# EAGLE design Timer-Ruler_v3 (EAGLE 7.5.0)
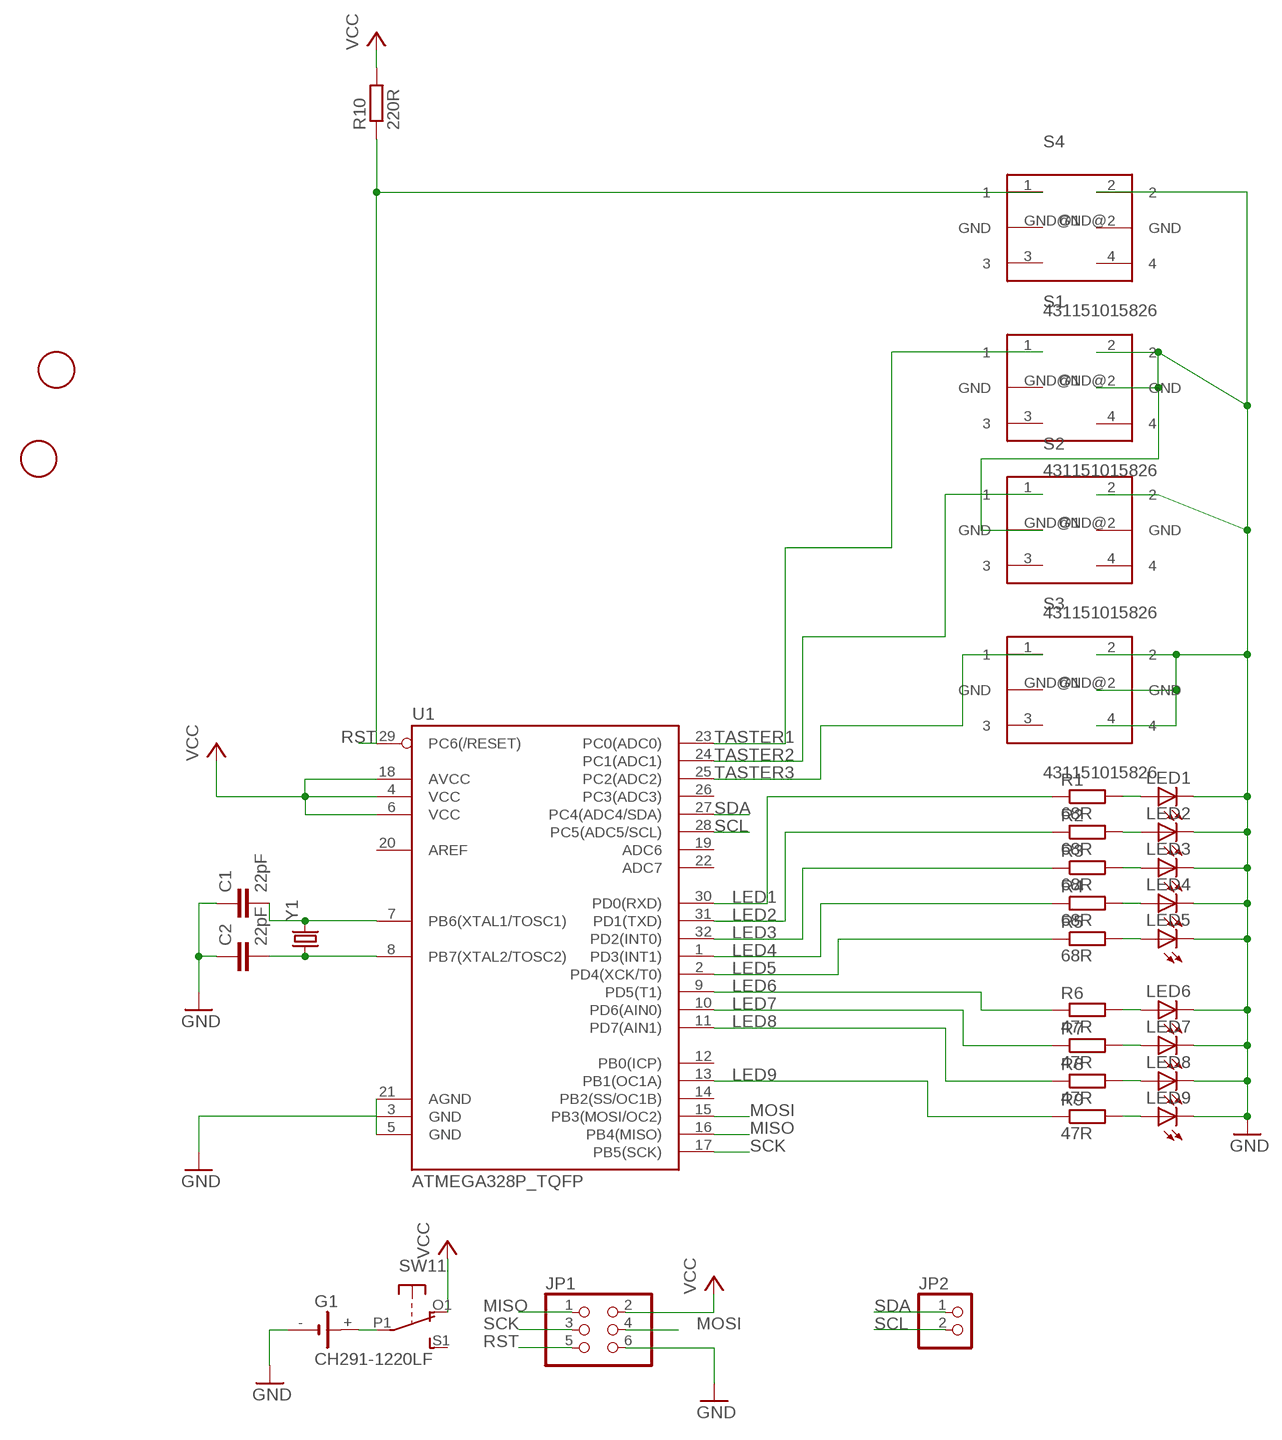
[diagram p0: schematic, sheet 1]

## Parts
C1  22pF  C-EUC0603  [C0603]
C2  22pF  C-EUC0603  [C0603]
G1  CH291-1220LF  [CH291-1220LF]
JP1  PINHD-2X3  [2X03]
JP2  PINHD-1X2  [1X02]
LED1  LEDCHIP-LED0805  [CHIP-LED0805]
LED2  LEDCHIP-LED0805  [CHIP-LED0805]
LED3  LEDCHIP-LED0805  [CHIP-LED0805]
LED4  LEDCHIP-LED0805  [CHIP-LED0805]
LED5  LEDCHIP-LED0805  [CHIP-LED0805]
LED6  LEDCHIP-LED0805  [CHIP-LED0805]
LED7  LEDCHIP-LED0805  [CHIP-LED0805]
LED8  LEDCHIP-LED0805  [CHIP-LED0805]
LED9  LEDCHIP-LED0805  [CHIP-LED0805]
R1  68R  R-EU_R0603  [R0603]
R2  68R  R-EU_R0603  [R0603]
R3  68R  R-EU_R0603  [R0603]
R4  68R  R-EU_R0603  [R0603]
R5  68R  R-EU_R0603  [R0603]
R6  47R  R-EU_R0603  [R0603]
R7  47R  R-EU_R0603  [R0603]
R8  47R  R-EU_R0603  [R0603]
R9  47R  R-EU_R0603  [R0603]
R10  220R  R-EU_R0603  [R0603]
S1  431151015826  [431181015816]
S2  431151015826  [431181015816]
S3  431151015826  [431181015816]
S4  431151015826  [431181015816]
SW1  DPDT-EG1390  [EG1390]
U1  ATMEGA328P_TQFP  [TQFP32-08]
U$1  FIDUCIAL  [FIDUCIAL_1MM]
U$2  FIDUCIAL  [FIDUCIAL_1MM]
Y1  CRYSTALCRYSTAL-SMD-5X3-12.288MHZ  [CRYSTAL-SMD-5X3]

## Nets
GND: C1.1 C2.1 G1.- JP1.6 LED1.C LED2.C LED3.C LED4.C LED5.C LED6.C LED7.C LED8.C LED9.C S1.2 S1.GND@2(GND) S2.2 S2.GND@1(GND) S3.2 S3.4 S3.GND@2(GND) S4.2 U1.3(GND)
LED1: R1.1 U1.30(PD0(RXD))
LED2: R2.1 U1.31(PD1(TXD))
LED3: R3.1 U1.32(PD2(INT0))
LED4: R4.1 U1.1(PD3(INT1))
LED5: R5.1 U1.2(PD4(XCK/T0))
LED6: R6.1 U1.9(PD5(T1))
LED7: R7.1 U1.10(PD6(AIN0))
LED8: R8.1 U1.11(PD7(AIN1))
LED9: R9.1 U1.13(PB1(OC1A))
MISO: JP1.1 U1.16(PB4(MISO))
MOSI: JP1.4 U1.15(PB3(MOSI/OC2))
N$1: LED1.A R1.2
N$2: LED2.A R2.2
N$3: LED3.A R3.2
N$4: LED4.A R4.2
N$5: LED5.A R5.2
N$6: LED6.A R6.2
N$7: LED7.A R7.2
N$8: LED8.A R8.2
N$9: LED9.A R9.2
N$10: C1.2 U1.7(PB6(XTAL1/TOSC1)) Y1.3
N$12: C2.2 U1.8(PB7(XTAL2/TOSC2)) Y1.1
N$13: U1.5(GND) U1.21(AGND)
N$14: G1.+ SW1.P1(1:P)
RST: JP1.5 R10.1 S4.1 U1.29(PC6(/RESET))
SCK: JP1.3 U1.17(PB5(SCK))
SCL: JP2.2 U1.28(PC5(ADC5/SCL))
SDA: JP2.1 U1.27(PC4(ADC4/SDA))
TASTER1: S1.1 U1.23(PC0(ADC0))
TASTER2: S2.1 U1.24(PC1(ADC1))
TASTER3: S3.1 U1.25(PC2(ADC2))
VCC: JP1.2 R10.2 SW1.O1(1:O) U1.4(VCC) U1.6(VCC) U1.18(AVCC)
Unconnected: S1.3 S1.4 S1.GND@1(GND) S2.3 S2.4 S2.GND@2(GND) S3.3 S3.GND@1(GND) S4.3 S4.4 S4.GND@1(GND) S4.GND@2(GND) SW1.O2(2:O) SW1.P2(2:P) SW1.S1(1:S) SW1.S2(2:S) U1.12(PB0(ICP)) U1.14(PB2(SS/OC1B)) U1.19(ADC6) U1.20(AREF) U1.22(ADC7) U1.26(PC3(ADC3))

## Library data of the parts
C1 C2 = resistor:C-EU: CAPACITOR, European symbol
G1 = battery:CH291-1220LF: Battery Holder, SMT, 12mm multicomp PART NO. CH291-1220LF Source: Data sheet <http://www.farnell.com/datasheets/1505860.pdf>
JP1 = pinhead:PINHD-2X3: PIN HEADER
JP2 = pinhead:PINHD-1X2: PIN HEADER
LED1-LED9 = led:LED: LED OSRAM: - CHIPLED LG R971, LG N971, LY N971, LG Q971, LY Q971, LO R971, LY R971 LH N974, LH R974 LS Q976, LO Q976, LY Q976 LO Q996 - Hyper CHIPLED LW Q18S LB Q993, LB Q99A, LB R99A - SideLED LS A670, LO A670, LY A670, LG A670, LP A670 LB A673, LV A673, LT A673, LW A673 LH A674 LY A675 LS A676, LA A676, LO A676, LY A676, LW A676 LS A679, LY A679, LG A679 - Hyper Micro SIDELED® LS Y876, LA Y876, LO Y876, LY Y876 LT Y87S - SmartLED LW L88C, LW L88S LB L89C, LB L89S, LG L890 LS L89K, LO L89K, LY L89K LS L896, LA L896, LO L896, LY L896 - TOPLED LS T670, LO T670, LY T670, LG T670, LP T670 LSG T670, LSP T670, LSY T670, LOP T670, LYG T670 LG T671, LOG T671, LSG T671 LB T673, LV T673, LT T673, LW T673 LH T674 LS T676, LA T676, LO T676, LY T676, LB T676, LH T676, LSB T676, LW T676 LB T67C, LV T67C, LT T67C, LS T67K, LO T67K, LY T67K, LW E67C LS E67B, LA E67B, LO E67B, LY E67B, LB E67C, LV E67C, LT E67C LW T67C LS T679, LY T679, LG T679 LS T770, LO T770, LY T770, LG T770, LP T770 LB T773, LV T773, LT T773, LW T773 LH T774 LS E675, LA E675, LY E675, LS T675 LS T776, LA T776, LO T776, LY T776, LB T776 LHGB T686 LT T68C, LB T68C - Hyper Mini TOPLED® LB M676 - Mini TOPLED Santana® LG M470 LS M47K, LO M47K, LY M47K Source: http://www.osram.convergy.de LUXEON: - LUMILED® LXK2-PW12-R00, LXK2-PW12-S00, LXK2-PW14-U00, LXK2-PW14-V00 LXK2-PM12-R00, LXK2-PM12-S00, LXK2-PM14-U00 LXK2-PE12-Q00, LXK2-PE12-R00, LXK2-PE12-S00, LXK2-PE14-T00, LXK2-PE14-U00 LXK2-PB12-K00, LXK2-PB12-L00, LXK2-PB12-M00, LXK2-PB14-N00, LXK2-PB14-P00, LXK2-PB14-Q00 LXK2-PR12-L00, LXK2-PR12-M00, LXK2-PR14-Q00, LXK2-PR14-R00 LXK2-PD12-Q00, LXK2-PD12-R00, LXK2-PD12-S00 LXK2-PH12-R00, LXK2-PH12-S00 LXK2-PL12-P00, LXK2-PL12-Q00, LXK2-PL12-R00 Source: www.luxeon.com KINGBRIGHT: KA-3528ASYC Source: www.kingbright.com
R1-R10 = resistor:R-EU_: RESISTOR, European symbol
S1-S4 = Wurth_Elektronik_Electromechanic_Switchs_rev15b:431151015826: WS-TSS-5x5 mm SMD Tact Switch with ground terminal, 4 pins
SW1 = adafruit:DPDT
U1 = SparkFun-DigitalIC:ATMEGA328P_TQFP; PROD_ID: IC-09069
U$1 U$2 = adafruit:FIDUCIAL: For use by pick and place machines to calibrate the vision/machine, 1mm By microbuilder.eu
Y1 = SparkFun-FreqCtrl:CRYSTAL: Various standard crystals. Proven footprints.; PROD_ID: XTAL-09653

## Board
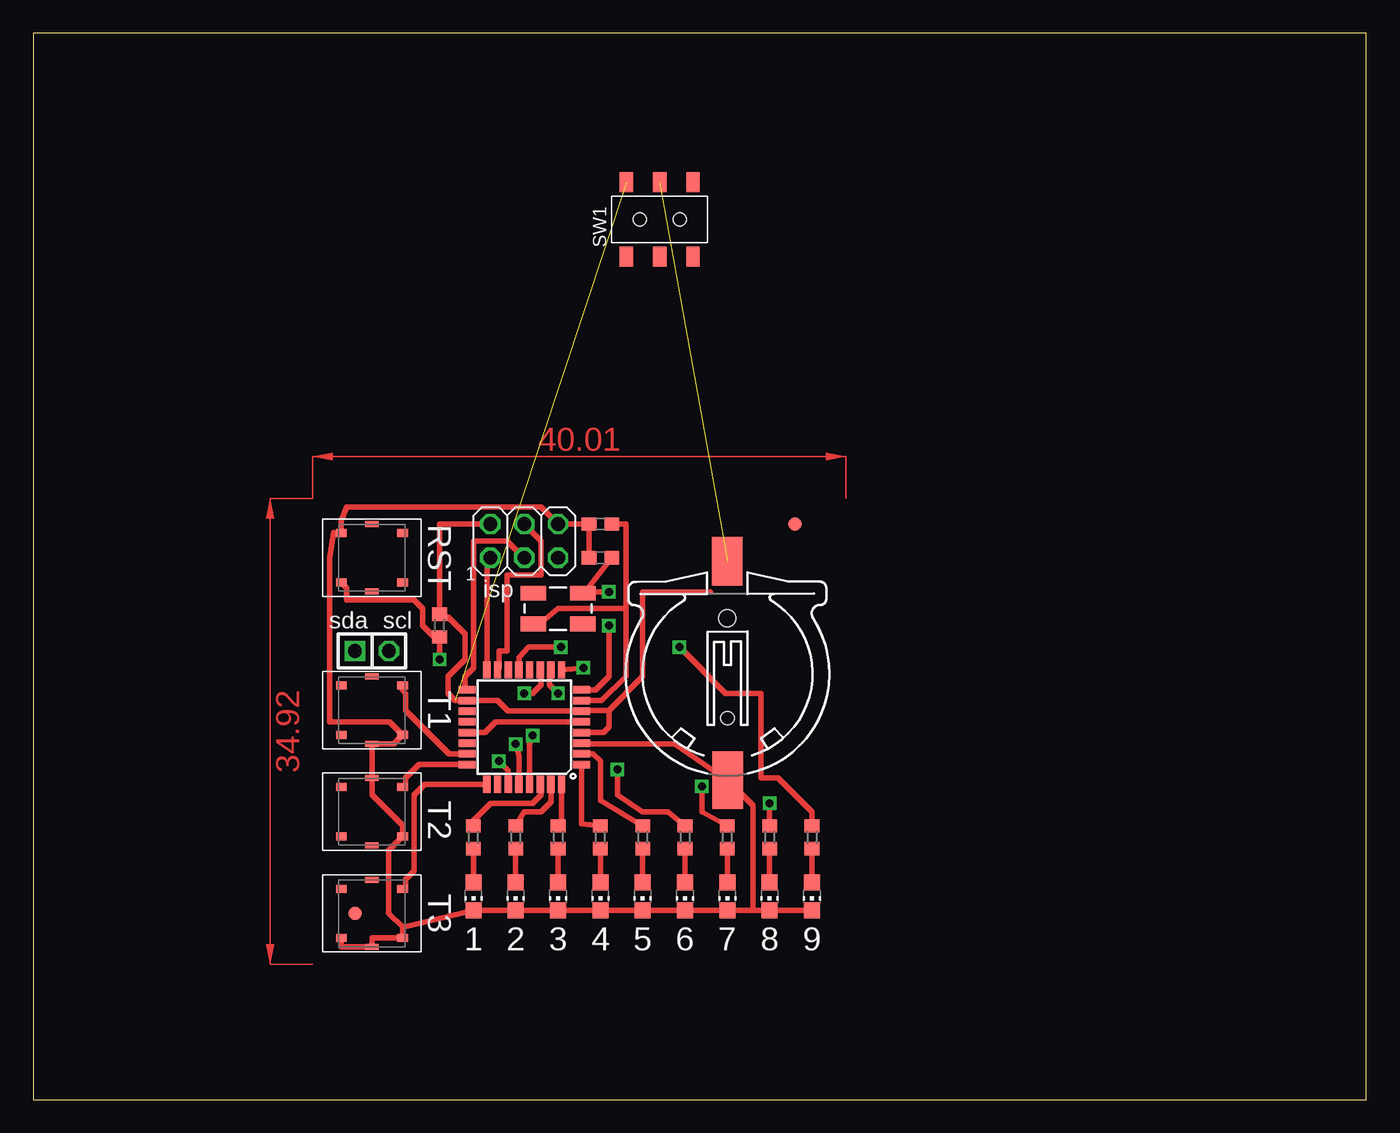
[diagram p1: board, top side]
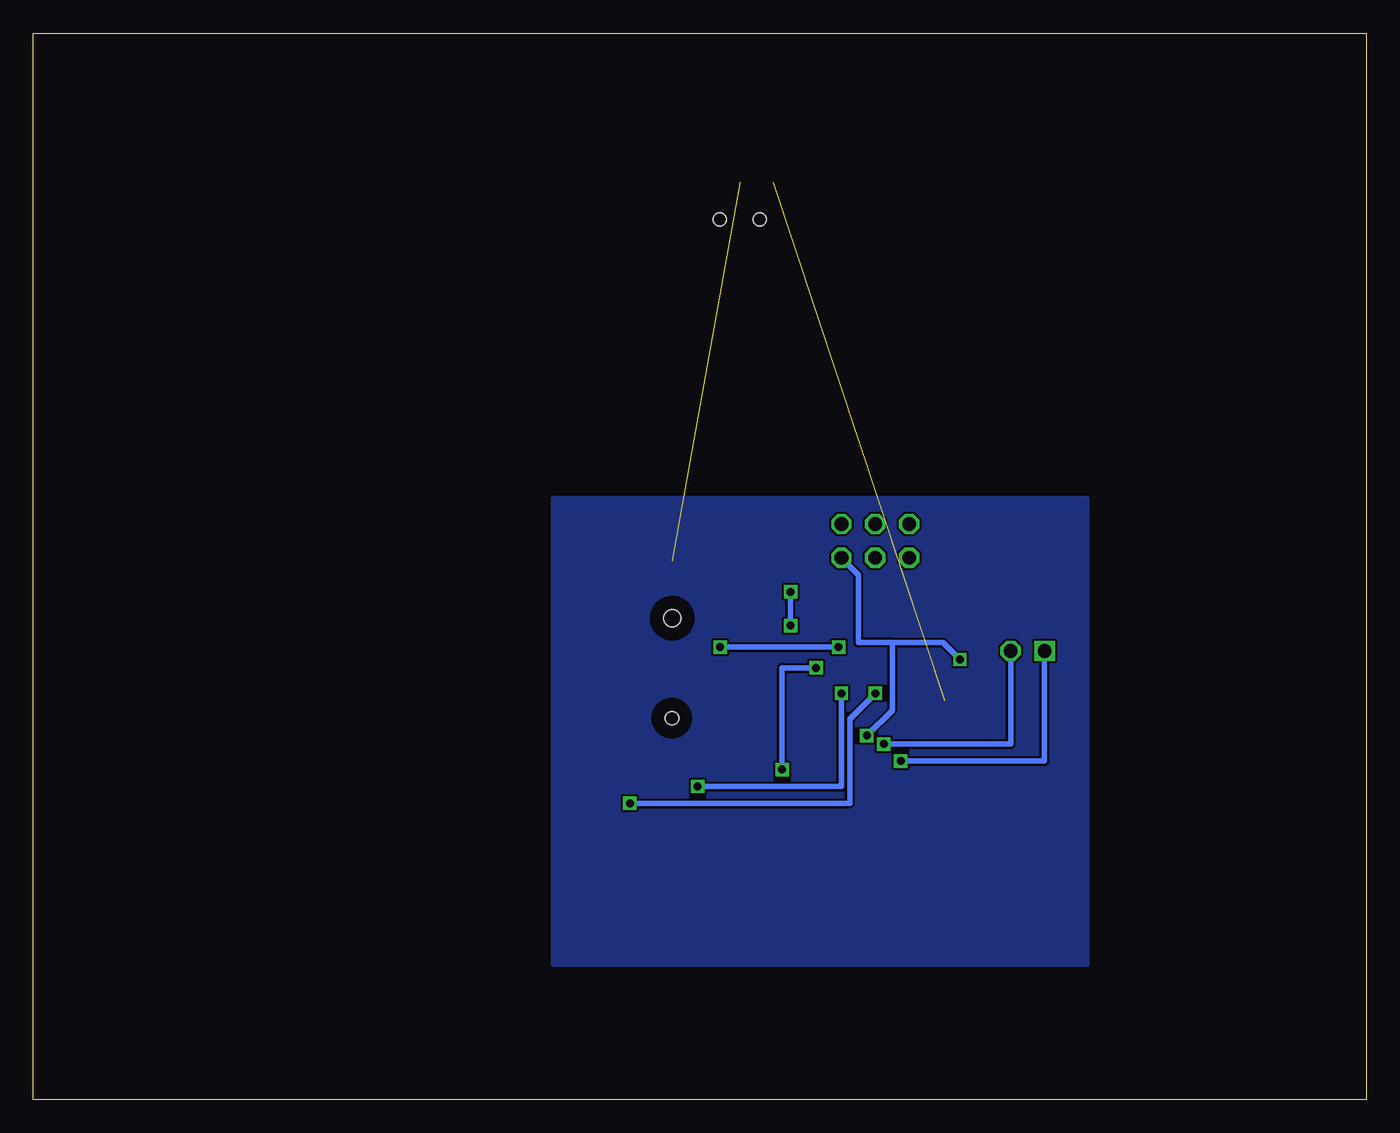
[diagram p2: board, bottom side, seen from below]

Size 100 x 80 mm. Coordinates in mm from the lower left corner, seen from the top.
Outline: 0,0 100,0 100,80 0,80 0,0
Copper layers (1*16): Top 0.035mm / dielectric 1.5mm / Bottom 0.035mm
Design rules "default *": minimum track width 0.4mm, minimum drill 0.4mm, track to track 7mil, track to pad 7mil, pad to pad 7mil, via to via 7mil, smd to smd 7mil, copper to edge 40mil, drill to drill 8mil, minimum pad ring 10mil, minimum via ring 8mil, stop-mask expansion 4mil, vias tented up to drill 0mil, thermal gap 10mil

### Footprints (pad centres in the part's own frame; a part is rotated, then mirrored left to right if it is on the bottom)
C0603 = smd 1.1 x 1: 1 -0.85,0; 2 0.85,0
CH291-1220LF = smd 2.3 x 3.66: + 0,-2.296 | smd 2.3 x 4.3: - 0,14.146 | hole 1.3: 0,2 | hole 1: 0,9.5
2X03 = drill 1.016 octagon: 1 -2.54,-1.27; 2 -2.54,1.27; 3 0,-1.27; 4 0,1.27; 5 2.54,-1.27; 6 2.54,1.27
1X02 = drill 1.016 square: 1 -1.27,0 | drill 1.016 octagon: 2 1.27,0
CHIP-LED0805 = smd 1.2 x 1.2: A 0,-1.05; C 0,1.05
R0603 = smd 1 x 1.1: 1 -0.85,0; 2 0.85,0
431181015816 = smd 0.8 x 0.6: 1 -2.3,-1.85; 2 -2.3,1.85; 3 2.3,-1.85; 4 2.3,1.85 | smd 1 x 0.45: GND@1 0,-2.525; GND@2 0,2.525
EG1390 = smd 1 x 1.5: O1 -2.5,2.8; O2 -2.5,-2.8; P1 0,2.8; P2 0,-2.8; S1 2.5,2.8; S2 2.5,-2.8 | hole 1: 1.5,0; -1.5,0
TQFP32-08 = smd 1.27 x 0.559: 1 -4.293,2.8; 2 -4.293,2; 3 -4.293,1.2; 4 -4.293,0.4; 5 -4.293,-0.4; 6 -4.293,-1.2; 7 -4.293,-2; 8 -4.293,-2.8; 17 4.293,-2.8; 18 4.293,-2; 19 4.293,-1.2; 20 4.293,-0.4; 21 4.293,0.4; 22 4.293,1.2; 23 4.293,2; 24 4.293,2.8 | smd 0.559 x 1.27: 9 -2.8,-4.293; 10 -2,-4.293; 11 -1.2,-4.293; 12 -0.4,-4.293; 13 0.4,-4.293; 14 1.2,-4.293; 15 2,-4.293; 16 2.8,-4.293; 25 2.8,4.293; 26 2,4.293; 27 1.2,4.293; 28 0.4,4.293; 29 -0.4,4.293; 30 -1.2,4.293; 31 -2,4.293; 32 -2.8,4.293
FIDUCIAL_1MM = smd 1 x 1: 1 0,0
CRYSTAL-SMD-5X3 = smd 1.9 x 1.1: 1 -1.85,-1.15; 2 1.85,-1.15; 3 1.85,1.15; 4 -1.85,1.15

### Placement (x,y rotation side)
C1  42.55,43.18 0 top
C2  42.55,40.64 0 top
G1  52.07,38.1 180.1 top
JP1  36.83,41.91 0 top
JP2  25.4,33.66 0 top
LED1  33.02,15.24 180 top
LED2  36.2,15.24 180 top
LED3  39.37,15.24 180 top
LED4  42.55,15.24 180 top
LED5  45.72,15.24 180 top
LED6  48.9,15.24 180 top
LED7  52.07,15.24 180 top
LED8  55.24,15.24 180 top
LED9  58.42,15.24 180 top
R1  33.02,19.68 270 top
R2  36.2,19.68 270 top
R3  39.37,19.68 270 top
R4  42.55,19.68 270 top
R5  45.72,19.68 270 top
R6  48.9,19.68 270 top
R7  52.07,19.68 270 top
R8  55.24,19.68 270 top
R9  58.42,19.68 270 top
R10  30.48,35.56 90 top
S1  25.4,29.21 180 top
S2  25.4,21.59 180 top
S3  25.4,13.97 180 top
S4  25.4,40.64 0 top
SW1  46.99,66.04 0 top
U1  36.83,27.94 180 top
U$1  57.15,43.18 0 top
U$2  24.13,13.97 0 top
Y1  39.37,36.83 180 top

### Tracks (layer width: path | path; a pad name or v marks a point on that pad's centre or on a via)
GND
  Top 0.406: 27.7,12.92 LED1.C LED2.C LED3.C LED4.C LED5.C LED6.C LED7.C 53.98,14.19 | 27.7,12.92 S3.2 25.4,12.12 S3.GND@2 23.1,11.45 S3.4 | S1.2 27.02,26.68 S1.GND@2 S2.GND@1 25.4,22.86 27.7,20.56 S2.2 26.67,18.71 26.67,13.97 27.7,12.94 27.7,12.92 | 27.88,27.54 S1.2 | C2.1 C1.1 JP1.6 38.1,44.45 23.5,44.45 23.1,43.42 S4.2 22.52,42.55 22.23,40.64 22.23,28.34 26.72,28.34 S1.2 | LED9.C LED8.C 53.98,14.19 | U1.3 41.19,26.67 48.11,26.67 G1.- 53.98,22.07 53.98,14.19
LED1
  Top 0.406: R1.1 33.02,20.95 34.29,22.23 37.47,22.23 38.1,22.86 38.1,23.58 U1.30
LED2
  Top 0.406: U1.31 38.83,22.32 38.1,21.59 36.83,21.59 R2.1
LED3
  Top 0.406: U1.32 39.63,20.8 R3.1
LED4
  Top 0.406: U1.1 41.12,20.69 R4.1
LED5
  Top 0.406: U1.2 42.01,25.94 42.55,25.4 42.55,22.44 R5.1
LED6  (via drill 0.6)
  Top 0.406: v41.27,32.38 U1.9 | R6.1 47.62,21.59 45.72,21.59 43.81,22.86 v43.81,24.77
  Bottom 0.406: v43.81,24.77 43.81,32.38 v41.27,32.38
LED7  (via drill 0.6)
  Top 0.406: R7.1 50.16,21.59 v50.16,23.5 | U1.10 38.73,32.14 38.73,31.11 v39.37,30.48
  Bottom 0.406: v50.16,23.5 39.37,23.5 v39.37,30.48
LED8  (via drill 0.6)
  Top 0.406: v36.83,30.48 37.47,30.48 38.1,31.11 38.1,32.16 U1.11 | R8.1 v55.24,22.23
  Bottom 0.406: v55.24,22.23 38.73,22.23 38.73,28.57 v36.83,30.48
LED9  (via drill 0.6)
  Top 0.406: R9.1 58.42,21.59 55.88,24.13 54.61,24.13 54.61,30.48 51.94,30.48 v48.47,33.95 | v39.58,33.95 37.16,33.96 36.45,33.16 36.45,32.25 U1.13
  Bottom 0.406: v48.47,33.95 v39.58,33.95
MISO
  Top 0.406: U1.16 34.03,40.38 JP1.1
MOSI
  Top 0.406: U1.15 34.92,32.33 34.92,33.66 35.56,33.66 35.56,39.37 38.1,39.37 38.1,41.91 JP1.4
N$1
  Top 0.406: R1.2 LED1.A
N$2
  Top 0.406: R2.2 LED2.A
N$3
  Top 0.406: R3.2 LED3.A
N$4
  Top 0.406: R4.2 LED4.A
N$5
  Top 0.406: R5.2 LED5.A
N$6
  Top 0.406: R6.2 LED6.A
N$7
  Top 0.406: R7.2 LED7.A
N$8
  Top 0.406: R8.2 LED8.A
N$9
  Top 0.406: R9.2 LED9.A
N$10
  Top 0.406: C1.2 44.45,43.18 44.45,36.83 | 44.45,36.83 44.45,31.75 42.64,29.94 U1.7 | Y1.3 37.98,35.68 39.37,36.83 44.45,36.83
N$11
  pour Bottom: 20.95,45.09 60.96,45.09 60.96,10.16 20.95,10.16
N$12  (via drill 0.6)
  Top 0.406: C2.2 41.49,38.25 Y1.1 41.34,38.1 v43.18,38.1 | U1.8 42.17,30.74 43.18,31.75 v43.18,35.56
  Bottom 0.406: v43.18,35.56 v43.18,38.1
N$13
  Top 0.406: U1.5 34.69,28.34 33.89,27.54 U1.21
N$14  (1 unrouted)
RST  (via drill 0.6)
  Top 0.406: S4.1 23.5,38.4 23.5,37.47 28.57,37.47 29.21,36.83 29.21,35.56 30.06,34.71 R10.1 v30.48,33.02 | U1.29 37.23,26.67 v37.47,27.3
  Bottom 0.406: v37.47,27.3 35.56,29.21 35.56,34.29 | 35.56,34.29 38.1,34.29 38.1,39.37 JP1.5 | 35.56,34.29 31.75,34.29 v30.48,33.02
SCK
  Top 0.406: U1.17 32.38,30.89 32.38,31.75 33.02,32.38 33.02,41.91 35.56,41.91 JP1.3
SCL  (via drill 0.6)
  Top 0.406: U1.28 36.43,25.8 v36.2,26.67
  Bottom 0.406: v36.2,26.67 26.67,26.67 JP2.2
SDA  (via drill 0.6)
  Top 0.406: U1.27 35.63,24.7 v34.92,25.4
  Bottom 0.406: v34.92,25.4 24.13,25.4 JP2.1
TASTER1
  Top 0.406: S1.1 27.7,30.72 27.94,30.48 27.94,29.21 31.21,25.94 U1.23
TASTER2
  Top 0.406: U1.24 28.95,25.14 27.94,24.13 27.94,23.68 S2.1
TASTER3
  Top 0.406: U1.25 29.36,23.65 28.57,22.86 28.57,17.14 27.94,16.51 27.94,16.06 S3.1
VCC  (1 unrouted)
  Top 0.406: 50.8,38.1 45.72,38.1 45.72,31.75 43.18,29.21 | 43.18,29.21 41.19,29.21 U1.6 35.63,29.14 34.83,29.94 U1.18 31.66,29.94 31.11,30.48 31.11,31.75 32.38,33.02 32.38,34.92 31.11,36.2 30.7,36.2 R10.2 30.48,43.18 JP1.2 | U1.4 42.78,27.54 43.18,27.94 43.18,29.21
(copper drawn outside any net)
  shapes: Top area x2

### Text on the board
tNames: RST | 1 | isp | sda | scl | T1 | T2 | T3 | 1 | 2 | 3 | 4 | 5 | 6 | 7 | 8 | 9